# Altium schematic sheet 03.Template_Indication.SchDoc
size 209 x 297 mm; Author: Мурашкин Д.В.; DocumentNumber: AB_BUSM_D01.R1; SheetNumber: 8; SheetTotal: 20; Scale: 1:1; Letter1Column: Э; PartName: Светодиодная индикация; CompanyName: Innoforce.kz; DocumentsNumber: AB_BUSM_D01.R1
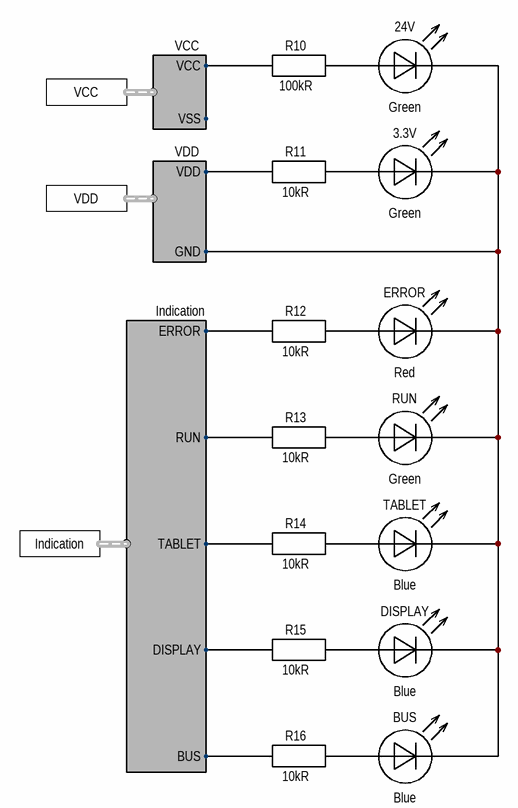
[diagram p0: 03.Template_Indication.SchDoc]

## Parts
3.3V  Green  [LED2012N]
24V  Green  [LED2012N]
BUS  Blue  [LED2012N]
DISPLAY  Blue  [LED2012N]
ERROR  Red  [LED2012N]
R10  100kR  [RESC2012N]
R11  10kR  [RESC2012N]
R12  10kR  [RESC2012N]
R13  10kR  [RESC2012N]
R14  10kR  [RESC2012N]
R15  10kR  [RESC2012N]
R16  10kR  [RESC2012N]
RUN  Green  [LED2012N]
TABLET  Blue  [LED2012N]

## Ports
Indication (harness Indication), VCC (harness VCC), VDD (harness VDD)

## Harnesses
Indication: RUN, TABLET, ERROR, DISPLAY, BUS
VDD: VDD, GND
VCC: VCC, VSS

## Nets
Net3.3V_1: 3.3V.1 24V.1 BUS.1 DISPLAY.1 ERROR.1 RUN.1 TABLET.1 ; port VDD.GND
Net3.3V_2: 3.3V.2 R11.2
Net24V_2: 24V.2 R10.2
NetBUS_2: BUS.2 R16.2
NetDISPLAY_2: DISPLAY.2 R15.2
NetERROR_2: ERROR.2 R12.2
NetR10_1: R10.1 ; port VCC.VCC
NetR11_1: R11.1 ; port VDD.VDD
NetR12_1: R12.1 ; port Indication.ERROR
NetR13_1: R13.1 ; port Indication.RUN
NetR13_2: R13.2 RUN.2
NetR14_1: R14.1 ; port Indication.TABLET
NetR14_2: R14.2 TABLET.2
NetR15_1: R15.1 ; port Indication.DISPLAY
NetR16_1: R16.1 ; port Indication.BUS

## Notes on the sheet
- Подп. и дата
- Инв. № дубл.
- Взам. инв. №
- Инв. № подл.
- Изм.
- Лист
- № докум.
- Подп.
- Дата
- 2.106-A4
- Копировал
- Формат А4

## Library data of the parts
3.3V 24V RUN = XL-2012UGC: Led Indication Green 2012; Manufacturer: XINGLIGHT; Wavelength: 525nm; Forward current: 30mA; Forward voltage: 3.2V; Group: Discrete; Item ID: XL-2012UGC; Part name: XL-2012UGC; Package: 2012; Color: Green; Operating temperature Min: -30°C; Operating temperature Max: +85°C; Width: 1.2mm; Length: 2.1mm; Height: 0.9mm; Mounting type: Surface mount; Supplier 1: LCSC; Supplier Part Number 1: C965815; Datasheet URL: http://www.xinglight.cn/uploadfile/202301/2127a4773e74ed4.pdf; Component URL: http://www.xinglight.cn/index.php?c=show&id=1071; Component: LED; Category: Indication; Value: Green
BUS DISPLAY TABLET = XL-2012UBC: Led Indication Blue 2012; Manufacturer: XINGLIGHT; Wavelength: 470nm; Forward current: 30mA; Forward voltage: 3.1V; Group: Discrete; Item ID: XL-2012UBC; Part name: XL-2012UBC; Package: 2012; Color: Blue; Operating temperature Min: -30°C; Operating temperature Max: +85°C; Width: 1.2mm; Length: 2.1mm; Height: 0.9mm; Mounting type: Surface mount; Supplier 1: LCSC; Supplier Part Number 1: C965817; Datasheet URL: http://www.xinglight.cn/uploadfile/202301/0b25401bf42e5d4.pdf; Component URL: http://www.xinglight.cn/index.php?c=show&id=1073; Component: LED; Category: Indication; Value: Blue
ERROR = XL-2012SURC: Led Indication Red 2012; Manufacturer: XINGLIGHT; Wavelength: 620nm; Forward current: 30mA; Forward voltage: 2.1V; Group: Discrete; Item ID: XL-2012SURC; Part name: XL-2012SURC; Package: 2012; Color: Red; Operating temperature Min: -30°C; Operating temperature Max: +85°C; Width: 1.2mm; Length: 2.1mm; Height: 0.9mm; Mounting type: Surface mount; Supplier 1: LCSC; Supplier Part Number 1: C965812; Datasheet URL: http://www.xinglight.cn/uploadfile/202301/06a5a26956f942a.pdf; Component URL: http://www.xinglight.cn/index.php?c=show&id=1068; Component: LED; Category: Indication; Value: Red
R10 = 0805W8F1003T5E: Resistor Ceramic 100kR 1% 2012; Manufacturer: UNI-ROYAL; Power: 125mW; Temperature coefficient: ±100ppm; Group: Discrete; Component: Resistors; Value code: 1003; Item ID: 0805W8F1003T5E; Part name: 0805W8F1003T5E; Package: 2012; Resistance: 100kR; Tolerance: ±1%; Technology: Thin film; Operating temperature Min: -55°C; Operating temperature Max: +125°C; Width: 1.25mm; Length: 2.0mm; Height: 0.55mm; Mounting type: Surface mount; Supplier 1: LCSC; Supplier Part Number 1: C149504; Datasheet URL: https://datasheet.lcsc.com/lcsc/2206010216_UNI-ROYAL-Uniroyal-Elec-0805W8F191JT5E_C17509.pdf?_gl=1*glxx84*_ga*MTk2MTgyMTQ2NS4xNzA5MTMzOTYz*_ga_98M84MKSZH*MTcwOTE1NjkxMy4zLjEuMTcwOTE1ODg4Ny42MC4wLjA.; Category: Ceramic; Value: 100kR
R11-R16 = 0805W8F1002T5E: Resistor Ceramic 10kR 1% 2012; Manufacturer: UNI-ROYAL; Power: 125mW; Temperature coefficient: ±100ppm; Group: Discrete; Component: Resistors; Value code: 1002; Item ID: 0805W8F1002T5E; Part name: 0805W8F1002T5E; Package: 2012; Resistance: 10kR; Tolerance: ±1%; Technology: Thin film; Operating temperature Min: -55°C; Operating temperature Max: +125°C; Width: 1.25mm; Length: 2.0mm; Height: 0.55mm; Mounting type: Surface mount; Supplier 1: LCSC; Supplier Part Number 1: C17414; Datasheet URL: https://datasheet.lcsc.com/lcsc/2206010216_UNI-ROYAL-Uniroyal-Elec-0805W8F1912T5E_C17508.pdf?_gl=1*13rsoe6*_ga*MTk2MTgyMTQ2NS4xNzA5MTMzOTYz*_ga_98M84MKSZH*MTcwOTE1NjkxMy4zLjEuMTcwOTE1OTk5Ni41NS4wLjA.; Category: Ceramic; Value: 10kR